# Altium schematic sheet FPGA.SchDoc: FMC DAC 1.5GS 4CH
size 420 x 297 mm; Author: G.Kasprowicz; CompanyName: WUT ISE; DrawnBy: G.Kasprowicz; Organization: WUT ISE; Address1: PW ISE; Address2: Nowowiejska 15/19 00-665 Warsaw; Address3: gkasprow@gmail.com; Revision: 1; SheetNumber: 19; SheetTotal: 25; ModifiedBy: -; CheckedDate: -; Title2: FMC; DivGrp: WUT ISE; Designer: G.Kasprowicz; ModifiedDate: -; ProjectName: Sensor Box
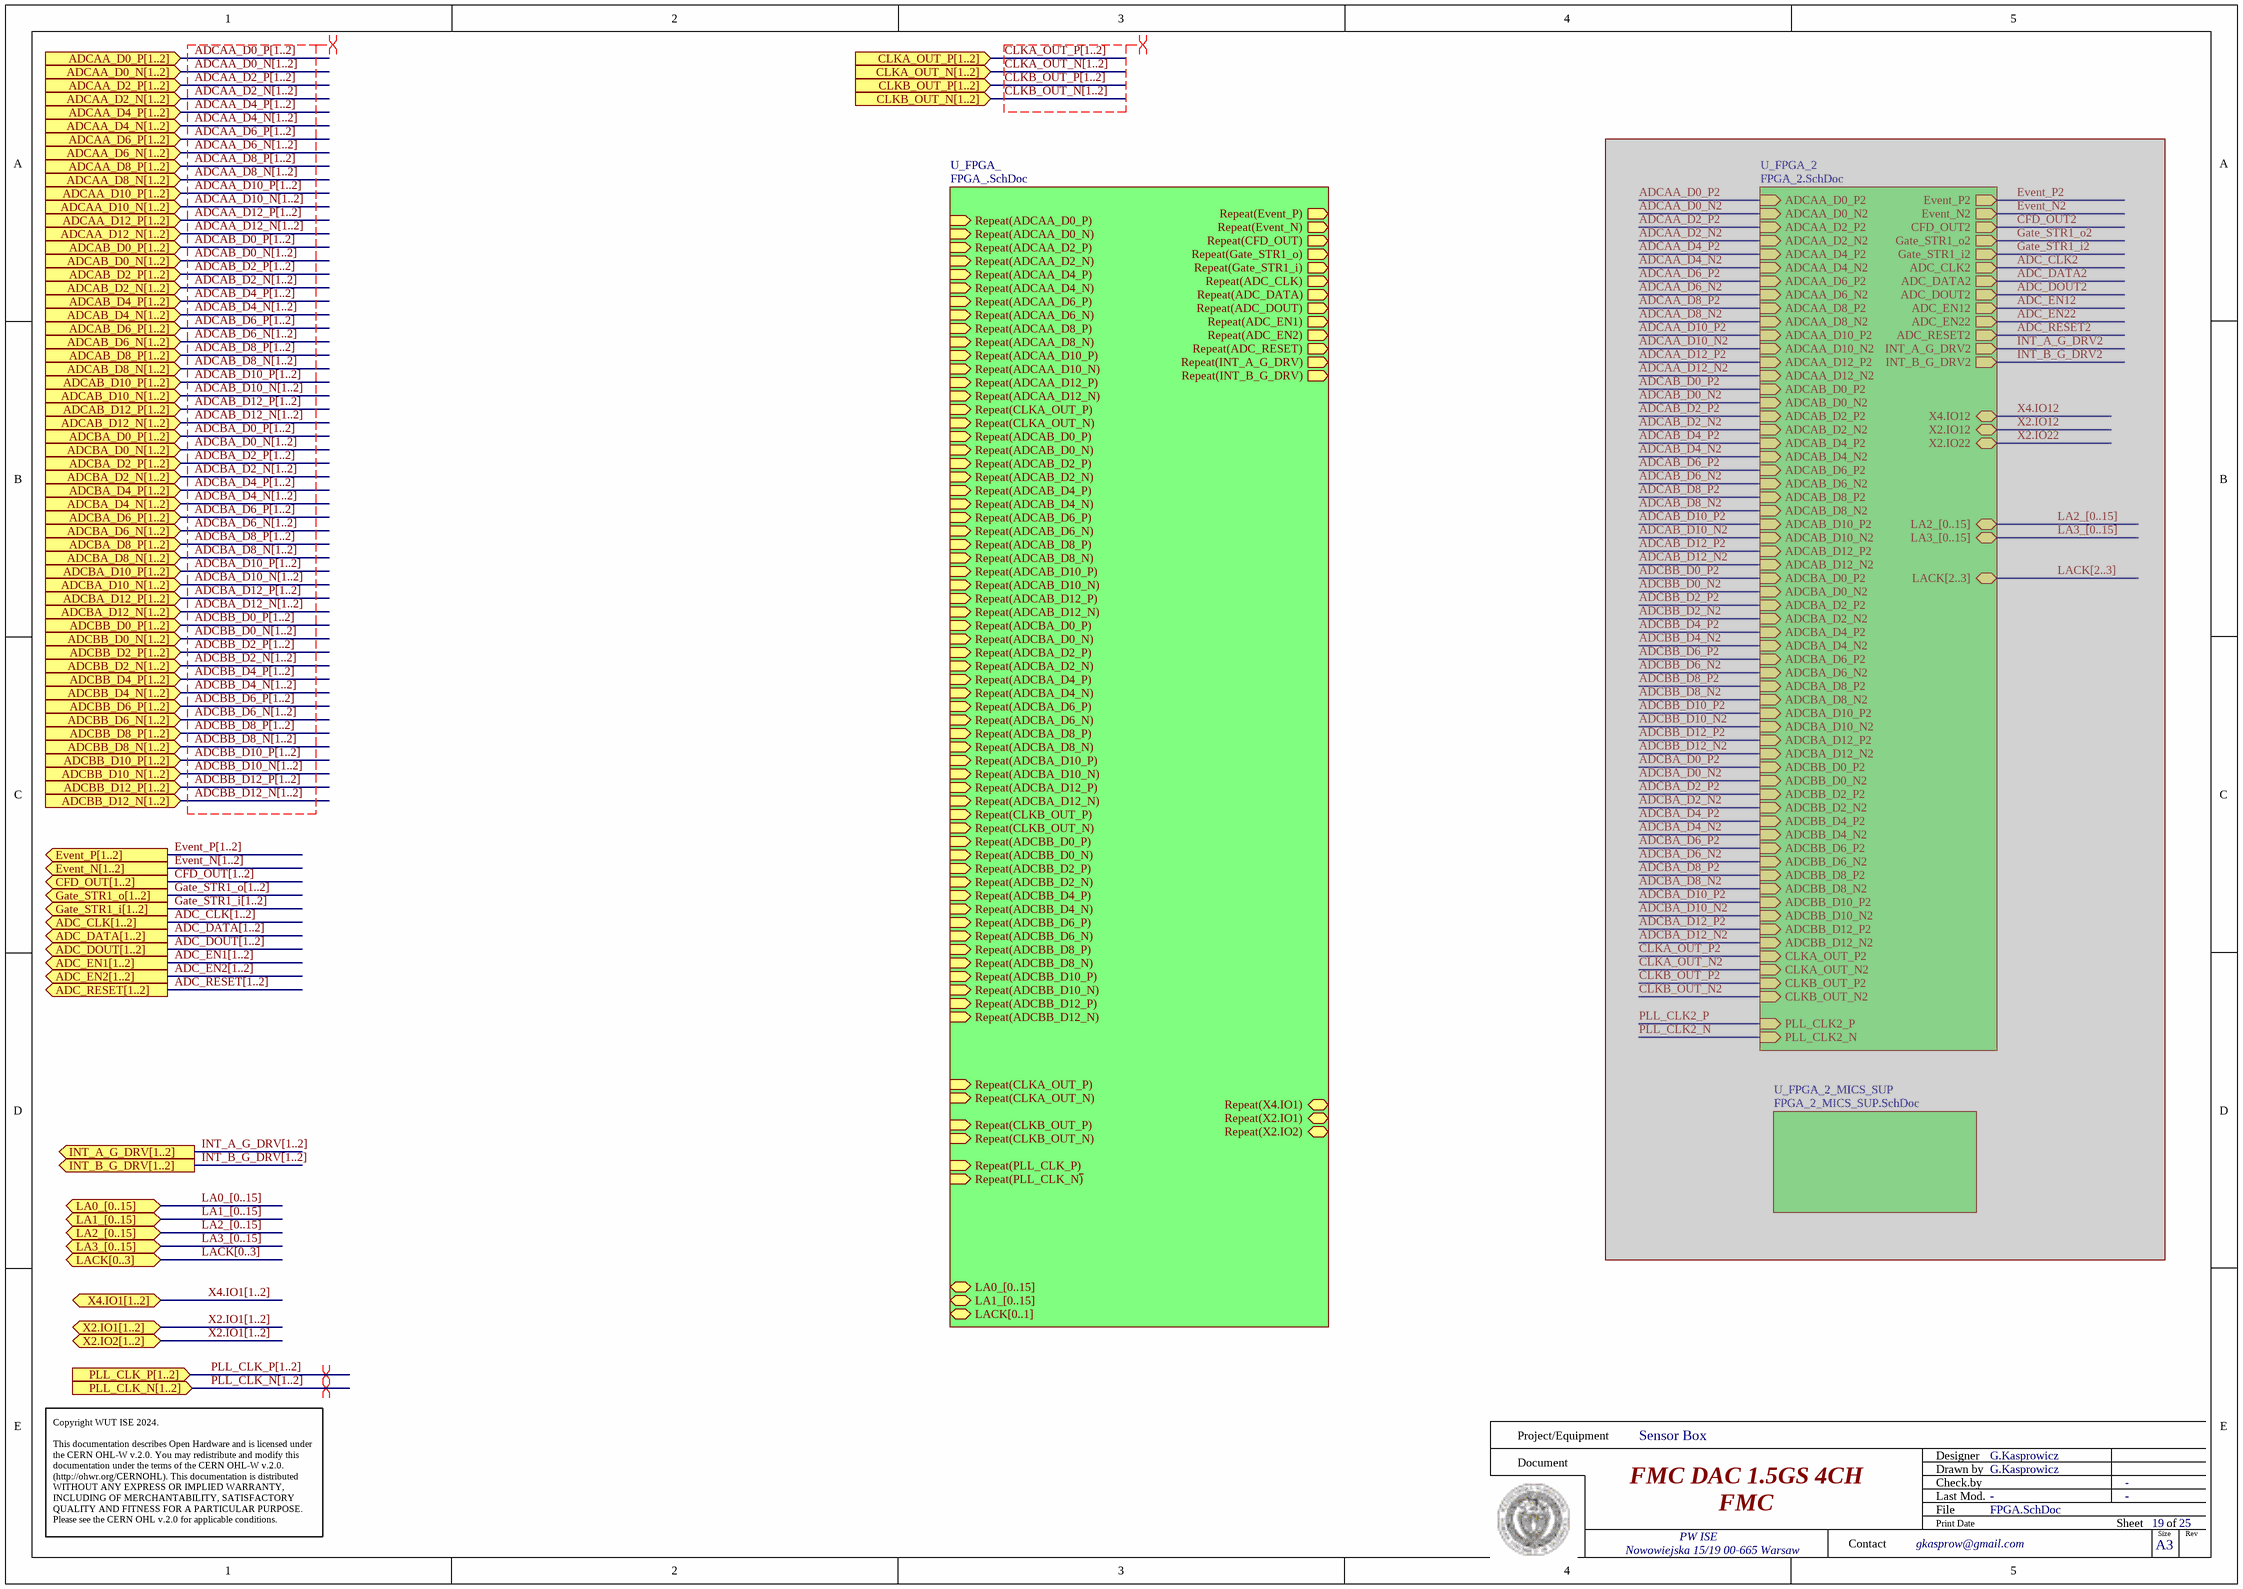
[diagram p0: FPGA.SchDoc]

## Sub-sheets
U_FPGA_ = FPGA_.SchDoc: Repeat(CLKA_OUT_P) (in), Repeat(CLKA_OUT_N) (in), Repeat(CLKB_OUT_P) (in), Repeat(CLKB_OUT_N) (in), Repeat(Event_P) (out), Repeat(Event_N) (out), Repeat(CFD_OUT) (out), Repeat(Gate_STR1_o) (out), Repeat(Gate_STR1_i) (out), Repeat(ADC_CLK) (out), Repeat(ADC_DATA) (out), Repeat(ADC_DOUT) (out), Repeat(ADC_EN1) (out), Repeat(ADC_EN2) (out), Repeat(ADC_RESET) (out), Repeat(PLL_CLK_P) (in), Repeat(PLL_CLK_N~{)} (in), Repeat(INT_A_G_DRV) (out), Repeat(INT_B_G_DRV) (out), LA0_[0..15] (bidir), LA1_[0..15] (bidir), LACK[0..1] (bidir), Repeat(X4.IO1) (bidir), Repeat(X2.IO1) (bidir), Repeat(X2.IO2) (bidir), Repeat(ADCAA_D0_P) (in), Repeat(ADCAA_D0_N) (in), Repeat(ADCAA_D2_P) (in), Repeat(ADCAA_D2_N) (in), Repeat(ADCAA_D4_P) (in), Repeat(ADCAA_D4_N) (in), Repeat(ADCAA_D6_P) (in), Repeat(ADCAA_D6_N) (in), Repeat(ADCAA_D8_P) (in), Repeat(ADCAA_D8_N) (in), Repeat(ADCAA_D10_P) (in), Repeat(ADCAA_D10_N) (in), Repeat(ADCAA_D12_P) (in), Repeat(ADCAA_D12_N) (in), Repeat(CLKA_OUT_P) (in), Repeat(CLKA_OUT_N) (in), Repeat(ADCAB_D0_P) (in), Repeat(ADCAB_D0_N) (in), Repeat(ADCAB_D2_P) (in), Repeat(ADCAB_D2_N) (in), Repeat(ADCAB_D4_P) (in), Repeat(ADCAB_D4_N) (in), Repeat(ADCAB_D6_P) (in), Repeat(ADCAB_D6_N) (in), Repeat(ADCAB_D8_P) (in), Repeat(ADCAB_D8_N) (in), Repeat(ADCAB_D10_P) (in), Repeat(ADCAB_D10_N) (in), Repeat(ADCAB_D12_P) (in), Repeat(ADCAB_D12_N) (in), Repeat(ADCBA_D0_P) (in), Repeat(ADCBA_D0_N) (in), Repeat(ADCBA_D2_P) (in), Repeat(ADCBA_D2_N) (in), Repeat(ADCBA_D4_P) (in), Repeat(ADCBA_D4_N) (in), Repeat(ADCBA_D6_P) (in), Repeat(ADCBA_D6_N) (in), Repeat(ADCBA_D8_P) (in), Repeat(ADCBA_D8_N) (in), Repeat(ADCBA_D10_P) (in), Repeat(ADCBA_D10_N) (in), Repeat(ADCBA_D12_P) (in), Repeat(ADCBA_D12_N) (in), Repeat(CLKB_OUT_P) (in), Repeat(CLKB_OUT_N) (in), Repeat(ADCBB_D0_P) (in), Repeat(ADCBB_D0_N) (in), Repeat(ADCBB_D2_P) (in), Repeat(ADCBB_D2_N) (in), Repeat(ADCBB_D4_P) (in), Repeat(ADCBB_D4_N) (in), Repeat(ADCBB_D6_P) (in), Repeat(ADCBB_D6_N) (in), Repeat(ADCBB_D8_P) (in), Repeat(ADCBB_D8_N) (in), Repeat(ADCBB_D10_P) (in), Repeat(ADCBB_D10_N) (in), Repeat(ADCBB_D12_P) (in), Repeat(ADCBB_D12_N) (in)
U_FPGA_2 = FPGA_2.SchDoc (masked out): ADCAA_D0_P2 (in), ADCAA_D0_N2 (in), ADCAA_D2_P2 (in), ADCAA_D2_N2 (in), ADCAA_D4_P2 (in), ADCAA_D4_N2 (in), ADCAA_D6_P2 (in), ADCAA_D6_N2 (in), ADCAA_D8_P2 (in), ADCAA_D8_N2 (in), ADCAA_D10_P2 (in), ADCAA_D10_N2 (in), ADCAA_D12_P2 (in), ADCAA_D12_N2 (in), ADCAB_D0_P2 (in), ADCAB_D0_N2 (in), ADCAB_D2_P2 (in), ADCAB_D2_N2 (in), ADCAB_D4_P2 (in), ADCAB_D4_N2 (in), ADCAB_D6_P2 (in), ADCAB_D6_N2 (in), ADCAB_D8_P2 (in), ADCAB_D8_N2 (in), ADCAB_D10_P2 (in), ADCAB_D10_N2 (in), ADCAB_D12_P2 (in), ADCAB_D12_N2 (in), ADCBA_D0_P2 (in), ADCBA_D0_N2 (in), ADCBA_D2_P2 (in), ADCBA_D2_N2 (in), ADCBA_D4_P2 (in), ADCBA_D4_N2 (in), ADCBA_D6_P2 (in), ADCBA_D6_N2 (in), ADCBA_D8_P2 (in), ADCBA_D8_N2 (in), ADCBA_D10_P2 (in), ADCBA_D10_N2 (in), ADCBA_D12_P2 (in), ADCBA_D12_N2 (in), ADCBB_D0_P2 (in), ADCBB_D0_N2 (in), ADCBB_D2_P2 (in), ADCBB_D2_N2 (in), ADCBB_D4_P2 (in), ADCBB_D4_N2 (in), ADCBB_D6_P2 (in), ADCBB_D6_N2 (in), ADCBB_D8_P2 (in), ADCBB_D8_N2 (in), ADCBB_D10_P2 (in), ADCBB_D10_N2 (in), ADCBB_D12_P2 (in), ADCBB_D12_N2 (in), CLKA_OUT_P2 (in), CLKA_OUT_N2 (in), CLKB_OUT_P2 (in), CLKB_OUT_N2 (in), Event_P2 (out), Event_N2 (out), CFD_OUT2 (out), Gate_STR1_o2 (out), Gate_STR1_i2 (out), ADC_CLK2 (out), ADC_DATA2 (out), ADC_DOUT2 (out), ADC_EN12 (out), ADC_EN22 (out), ADC_RESET2 (out), INT_A_G_DRV2 (out), INT_B_G_DRV2 (out), PLL_CLK2_P (in), PLL_CLK2_N (in), LA2_[0..15] (bidir), LA3_[0..15] (bidir), LACK[2..3] (bidir), X4.IO12 (bidir), X2.IO12 (bidir), X2.IO22 (bidir)
U_FPGA_2_MICS_SUP = FPGA_2_MICS_SUP.SchDoc (masked out): no entries

## Ports
ADC_CLK[1..2] (out), ADC_DATA[1..2] (out), ADC_DOUT[1..2] (out), ADC_EN1[1..2] (out), ADC_EN2[1..2] (out), ADC_RESET[1..2] (out), ADCAA_D0_N[1..2] (in), ADCAA_D0_P[1..2] (in), ADCAA_D2_N[1..2] (in), ADCAA_D2_P[1..2] (in), ADCAA_D4_N[1..2] (in), ADCAA_D4_P[1..2] (in), ADCAA_D6_N[1..2] (in), ADCAA_D6_P[1..2] (in), ADCAA_D8_N[1..2] (in), ADCAA_D8_P[1..2] (in), ADCAA_D10_N[1..2] (in), ADCAA_D10_P[1..2] (in), ADCAA_D12_N[1..2] (in), ADCAA_D12_P[1..2] (in), ADCAB_D0_N[1..2] (in), ADCAB_D0_P[1..2] (in), ADCAB_D2_N[1..2] (in), ADCAB_D2_P[1..2] (in), ADCAB_D4_N[1..2] (in), ADCAB_D4_P[1..2] (in), ADCAB_D6_N[1..2] (in), ADCAB_D6_P[1..2] (in), ADCAB_D8_N[1..2] (in), ADCAB_D8_P[1..2] (in), ADCAB_D10_N[1..2] (in), ADCAB_D10_P[1..2] (in), ADCAB_D12_N[1..2] (in), ADCAB_D12_P[1..2] (in), ADCBA_D0_N[1..2] (in), ADCBA_D0_P[1..2] (in), ADCBA_D2_N[1..2] (in), ADCBA_D2_P[1..2] (in), ADCBA_D4_N[1..2] (in), ADCBA_D4_P[1..2] (in), ADCBA_D6_N[1..2] (in), ADCBA_D6_P[1..2] (in), ADCBA_D8_N[1..2] (in), ADCBA_D8_P[1..2] (in), ADCBA_D10_N[1..2] (in), ADCBA_D10_P[1..2] (in), ADCBA_D12_N[1..2] (in), ADCBA_D12_P[1..2] (in), ADCBB_D0_N[1..2] (in), ADCBB_D0_P[1..2] (in), ADCBB_D2_N[1..2] (in), ADCBB_D2_P[1..2] (in), ADCBB_D4_N[1..2] (in), ADCBB_D4_P[1..2] (in), ADCBB_D6_N[1..2] (in), ADCBB_D6_P[1..2] (in), ADCBB_D8_N[1..2] (in), ADCBB_D8_P[1..2] (in), ADCBB_D10_N[1..2] (in), ADCBB_D10_P[1..2] (in), ADCBB_D12_N[1..2] (in), ADCBB_D12_P[1..2] (in), CFD_OUT[1..2] (out), CLKA_OUT_N[1..2] (in), CLKA_OUT_P[1..2] (in), CLKB_OUT_N[1..2] (in), CLKB_OUT_P[1..2] (in), Event_N[1..2] (out), Event_P[1..2] (out), Gate_STR1_i[1..2] (out), Gate_STR1_o[1..2] (out), INT_A_G_DRV[1..2] (out), INT_B_G_DRV[1..2] (out), LA0_[0..15] (bidir), LA1_[0..15] (bidir), LA2_[0..15] (bidir), LA3_[0..15] (bidir), LACK[0..3] (bidir), PLL_CLK_N[1..2] (in), PLL_CLK_P[1..2] (in), X2.IO1[1..2] (bidir), X2.IO2[1..2] (bidir), X4.IO1[1..2] (bidir)

## Buses and harness runs
bus ADC_CLK[1..2] = port ADC_CLK[1..2]
bus ADC_DATA[1..2] = port ADC_DATA[1..2]
bus ADC_DOUT[1..2] = port ADC_DOUT[1..2]
bus ADC_EN1[1..2] = port ADC_EN1[1..2]
bus ADC_EN2[1..2] = port ADC_EN2[1..2]
bus ADC_RESET[1..2] = port ADC_RESET[1..2]
bus ADCAA_D0_N[1..2] = port ADCAA_D0_N[1..2]
bus ADCAA_D0_P[1..2] = port ADCAA_D0_P[1..2]
bus ADCAA_D2_N[1..2] = port ADCAA_D2_N[1..2]
bus ADCAA_D2_P[1..2] = port ADCAA_D2_P[1..2]
bus ADCAA_D4_N[1..2] = port ADCAA_D4_N[1..2]
bus ADCAA_D4_P[1..2] = port ADCAA_D4_P[1..2]
bus ADCAA_D6_N[1..2] = port ADCAA_D6_N[1..2]
bus ADCAA_D6_P[1..2] = port ADCAA_D6_P[1..2]
bus ADCAA_D8_N[1..2] = port ADCAA_D8_N[1..2]
bus ADCAA_D8_P[1..2] = port ADCAA_D8_P[1..2]
bus ADCAA_D10_N[1..2] = port ADCAA_D10_N[1..2]
bus ADCAA_D10_P[1..2] = port ADCAA_D10_P[1..2]
bus ADCAA_D12_N[1..2] = port ADCAA_D12_N[1..2]
bus ADCAA_D12_P[1..2] = port ADCAA_D12_P[1..2]
bus ADCAB_D0_N[1..2] = port ADCAB_D0_N[1..2]
bus ADCAB_D0_P[1..2] = port ADCAB_D0_P[1..2]
bus ADCAB_D2_N[1..2] = port ADCAB_D2_N[1..2]
bus ADCAB_D2_P[1..2] = port ADCAB_D2_P[1..2]
bus ADCAB_D4_N[1..2] = port ADCAB_D4_N[1..2]
bus ADCAB_D4_P[1..2] = port ADCAB_D4_P[1..2]
bus ADCAB_D6_N[1..2] = port ADCAB_D6_N[1..2]
bus ADCAB_D6_P[1..2] = port ADCAB_D6_P[1..2]
bus ADCAB_D8_N[1..2] = port ADCAB_D8_N[1..2]
bus ADCAB_D8_P[1..2] = port ADCAB_D8_P[1..2]
bus ADCAB_D10_N[1..2] = port ADCAB_D10_N[1..2]
bus ADCAB_D10_P[1..2] = port ADCAB_D10_P[1..2]
bus ADCAB_D12_N[1..2] = port ADCAB_D12_N[1..2]
bus ADCAB_D12_P[1..2] = port ADCAB_D12_P[1..2]
bus ADCBA_D0_N[1..2] = port ADCBA_D0_N[1..2]
bus ADCBA_D0_P[1..2] = port ADCBA_D0_P[1..2]
bus ADCBA_D2_N[1..2] = port ADCBA_D2_N[1..2]
bus ADCBA_D2_P[1..2] = port ADCBA_D2_P[1..2]
bus ADCBA_D4_N[1..2] = port ADCBA_D4_N[1..2]
bus ADCBA_D4_P[1..2] = port ADCBA_D4_P[1..2]
bus ADCBA_D6_N[1..2] = port ADCBA_D6_N[1..2]
bus ADCBA_D6_P[1..2] = port ADCBA_D6_P[1..2]
bus ADCBA_D8_N[1..2] = port ADCBA_D8_N[1..2]
bus ADCBA_D8_P[1..2] = port ADCBA_D8_P[1..2]
bus ADCBA_D10_N[1..2] = port ADCBA_D10_N[1..2]
bus ADCBA_D10_P[1..2] = port ADCBA_D10_P[1..2]
bus ADCBA_D12_N[1..2] = port ADCBA_D12_N[1..2]
bus ADCBA_D12_P[1..2] = port ADCBA_D12_P[1..2]
bus ADCBB_D0_N[1..2] = port ADCBB_D0_N[1..2]
bus ADCBB_D0_P[1..2] = port ADCBB_D0_P[1..2]
bus ADCBB_D2_N[1..2] = port ADCBB_D2_N[1..2]
bus ADCBB_D2_P[1..2] = port ADCBB_D2_P[1..2]
bus ADCBB_D4_N[1..2] = port ADCBB_D4_N[1..2]
bus ADCBB_D4_P[1..2] = port ADCBB_D4_P[1..2]
bus ADCBB_D6_N[1..2] = port ADCBB_D6_N[1..2]
bus ADCBB_D6_P[1..2] = port ADCBB_D6_P[1..2]
bus ADCBB_D8_N[1..2] = port ADCBB_D8_N[1..2]
bus ADCBB_D8_P[1..2] = port ADCBB_D8_P[1..2]
bus ADCBB_D10_N[1..2] = port ADCBB_D10_N[1..2]
bus ADCBB_D10_P[1..2] = port ADCBB_D10_P[1..2]
bus ADCBB_D12_N[1..2] = port ADCBB_D12_N[1..2]
bus ADCBB_D12_P[1..2] = port ADCBB_D12_P[1..2]
bus CFD_OUT[1..2] = port CFD_OUT[1..2]
bus CLKA_OUT_N[1..2] = port CLKA_OUT_N[1..2]
bus CLKA_OUT_P[1..2] = port CLKA_OUT_P[1..2]
bus CLKB_OUT_N[1..2] = port CLKB_OUT_N[1..2]
bus CLKB_OUT_P[1..2] = port CLKB_OUT_P[1..2]
bus Event_N[1..2] = port Event_N[1..2]
bus Event_P[1..2] = port Event_P[1..2]
bus Gate_STR1_i[1..2] = port Gate_STR1_i[1..2]
bus Gate_STR1_o[1..2] = port Gate_STR1_o[1..2]
bus INT_A_G_DRV[1..2] = port INT_A_G_DRV[1..2]
bus INT_B_G_DRV[1..2] = port INT_B_G_DRV[1..2]
bus LA0_[0..15] = port LA0_[0..15]
bus LA1_[0..15] = port LA1_[0..15]
bus LA2_[0..15] = port LA2_[0..15]
bus LA3_[0..15] = port LA3_[0..15]
bus LACK[0..3] = port LACK[0..3]
bus PLL_CLK_N[1..2] = port PLL_CLK_N[1..2]
bus PLL_CLK_P[1..2] = port PLL_CLK_P[1..2]
bus X2.IO1[1..2] = port X2.IO1[1..2]
bus X2.IO1[1..2] = port X2.IO2[1..2]
bus X4.IO1[1..2] = port X4.IO1[1..2]

## Layout directives
differential pair; differential pair class D100: (no net found under the mark), ADCAA_D0_N[1..2], ADCAA_D0_P[1..2], ADCAA_D2_N[1..2], ADCAA_D2_P[1..2], ADCAA_D4_N[1..2], ADCAA_D4_P[1..2], ADCAA_D6_N[1..2], ADCAA_D6_P[1..2], ADCAA_D8_N[1..2], ADCAA_D8_P[1..2], ADCAA_D10_N[1..2], ADCAA_D10_P[1..2], ADCAA_D12_N[1..2], ADCAA_D12_P[1..2], ADCAB_D0_N[1..2], ADCAB_D0_P[1..2], ADCAB_D2_N[1..2], ADCAB_D2_P[1..2], ADCAB_D4_N[1..2], ADCAB_D4_P[1..2], ADCAB_D6_N[1..2], ADCAB_D6_P[1..2], ADCAB_D8_N[1..2], ADCAB_D8_P[1..2], ADCAB_D10_N[1..2], ADCAB_D10_P[1..2], ADCAB_D12_N[1..2], ADCAB_D12_P[1..2], ADCBA_D0_N[1..2], ADCBA_D0_P[1..2], ADCBA_D2_N[1..2], ADCBA_D2_P[1..2], ADCBA_D4_N[1..2], ADCBA_D4_P[1..2], ADCBA_D6_N[1..2], ADCBA_D6_P[1..2], ADCBA_D8_N[1..2], ADCBA_D8_P[1..2], ADCBA_D10_N[1..2], ADCBA_D10_P[1..2], ADCBA_D12_N[1..2], ADCBA_D12_P[1..2], ADCBB_D0_N[1..2], ADCBB_D0_P[1..2], ADCBB_D2_N[1..2], ADCBB_D2_P[1..2], ADCBB_D4_N[1..2], ADCBB_D4_P[1..2], ADCBB_D6_N[1..2], ADCBB_D6_P[1..2], ADCBB_D8_N[1..2], ADCBB_D8_P[1..2], ADCBB_D10_N[1..2], ADCBB_D10_P[1..2], ADCBB_D12_N[1..2], ADCBB_D12_P[1..2], CLKA_OUT_N[1..2], CLKA_OUT_P[1..2], CLKB_OUT_N[1..2], CLKB_OUT_P[1..2]

## Notes on the sheet
- Project/Equipment
- Document
- Designer
- Drawn by
- Check.by
- Copyright WUT ISE 2024.
  This documentation describes Open Hardware and is licensed under the CERN OHL-W v.2.0. You may redistribute and modify this documentation under the terms of the CERN OHL-W v.2.0. (http://ohwr.org/CERNOHL). This documentation is distributed WITHOUT ANY EXPRESS OR IMPLIED WARRANTY, INCLUDING OF MERCHANTABILITY, SATISFACTORY QUALITY AND FITNESS FOR A PARTICULAR PURPOSE. Please see the CERN OHL v.2.0 for applicable conditions.
- Contact
- File
- Last Mod.
- Print Date
- Sheet
- Size
- A3
- of
- Rev